# EasyEDA Pro project ProPrj_辉光管时钟V1.0_2025-10-09.epro, board 驱动
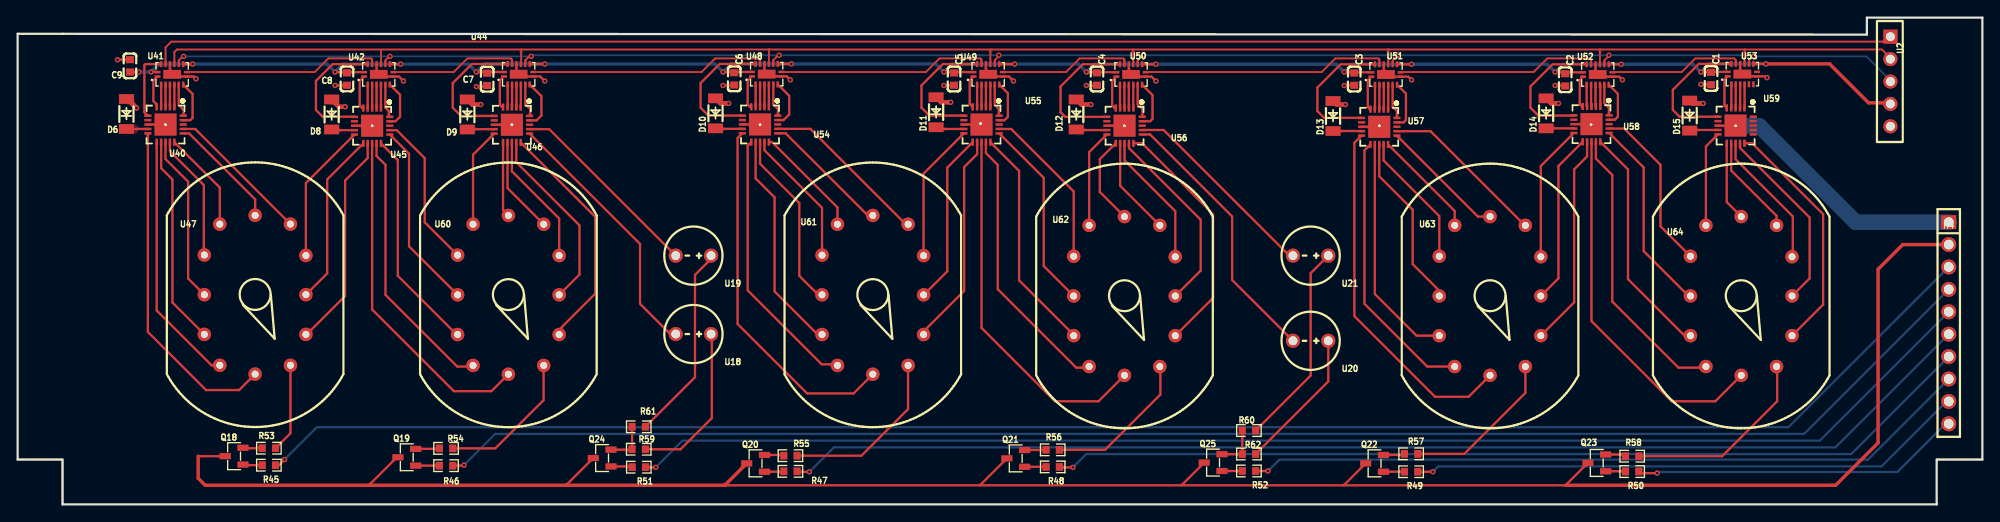
[diagram p12: board, top side]
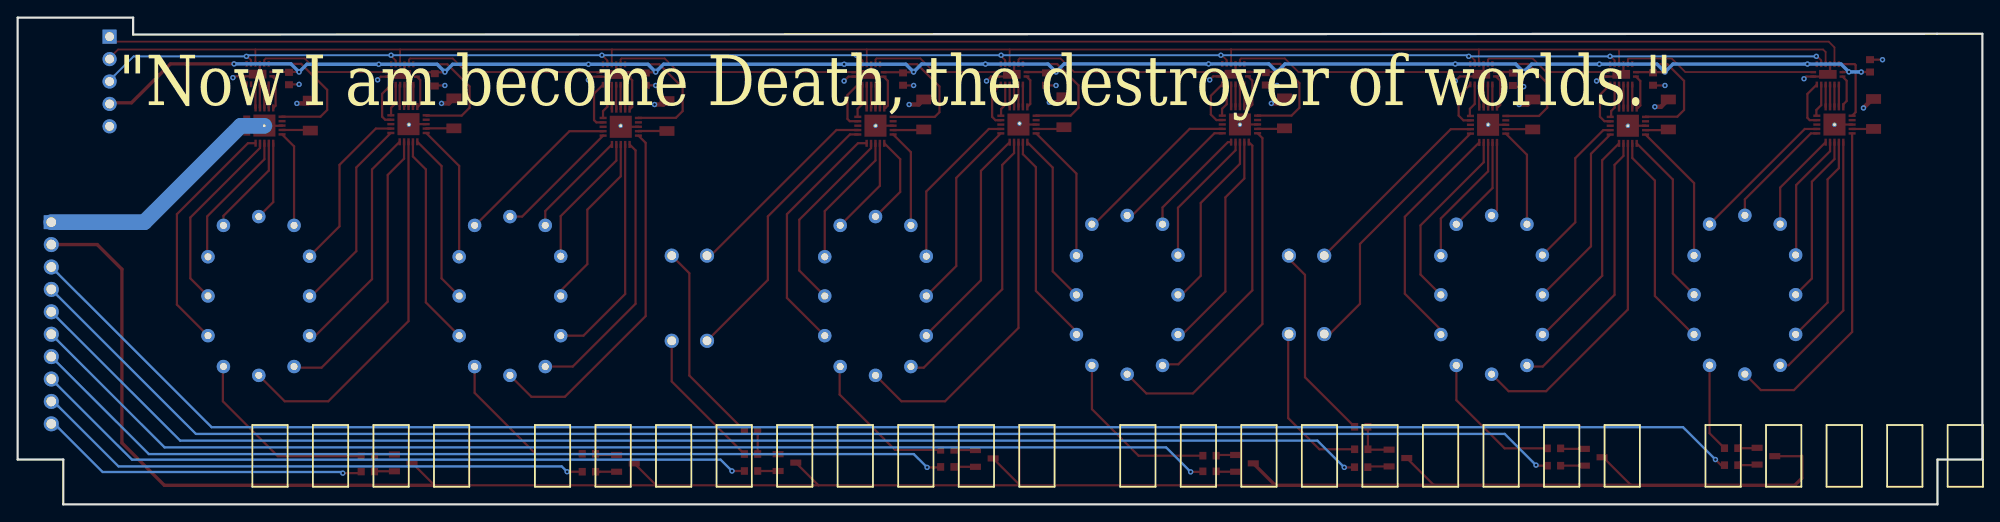
[diagram p13: board, bottom side, seen from below]

Outline 222.5 x 55.17 mm; copper layers: Top Layer, Bottom Layer. Coordinates in mm from the lower left corner of the outline.
Outline path: 0,53.34 0,5.08 5.08,5.08 5.08,0 217.34,0 217.34,5.08 222.5,5.08 222.5,55.17 209.43,55.17 209.43,53.25 5.12,53.34 0,53.34
Stack: Top Layer 0.035mm / Dielectric1 1.51mm FR4 er 4.5 / Bottom Layer 0.035mm

## Design rules (mm)
template: JLCPCB Capability(Two Layers Board)
spacing copperThickness1oz (default): track to track 0.102, other pairs 0.152 to 0.3
spacing copperThickness2oz: track to track 0.203, other pairs 0.152 to 0.3
track width copperThickness1oz (default): min 0.127, default 0.254, max 2.54
track width copperThickness2oz: min 0.203, default 0.254, max 2.54
differential pair differentialPair (default): width min 0.127, default 0.254, max 2.54; gap min 0.152, default 0.152
via viaSize (default): diameter min 0.5, default 0.61, max 10; hole min 0.3, default 0.305, max 6.3

## Placement (name value [footprint] x y rotation side)
C1  100nF  [C0603]  191.78 48.27 270 top
C2  100nF  [C0603]  175.26 48.12 270 top
C3  100nF  [C0603]  151.37 48.2 270 top
C4  100nF  [C0603]  122.23 48.21 270 top
C5  100nF  [C0603]  106.04 48.21 270 top
C6  100nF  [C0603]  81.15 48.23 270 top
C7  100nF  [C0603]  53.17 48.18 270 top
C8  100nF  [C0603]  37.29 48.21 270 top
C9  100nF  [C0603]  12.72 49.71 90 top
D6  ZMM51  [LL-34_L3.5-W1.5-RD]  12.32 44.25 90 top
D8  ZMM51  [LL-34_L3.5-W1.5-RD]  35.56 44.2 90 top
D9  ZMM51  [LL-34_L3.5-W1.5-RD]  50.93 44.2 90 top
D10  ZMM51  [LL-34_L3.5-W1.5-RD]  79.03 44.32 90 top
D11  ZMM51  [LL-34_L3.5-W1.5-RD]  104.01 44.45 90 top
D12  ZMM51  [LL-34_L3.5-W1.5-RD]  119.89 44.2 90 top
D13  ZMM51  [LL-34_L3.5-W1.5-RD]  148.97 44.02 90 top
D14  ZMM51  [LL-34_L3.5-W1.5-RD]  173.1 44.32 90 top
D15  ZMM51  [LL-34_L3.5-W1.5-RD]  189.36 44.07 90 top
H4  MH254V-11-10-1196  [HDR-TH_10P-P2.54-V-M]  218.7 20.56 270 top
NOREF  -  [Pad_e20424]  109.05 43.16 0 top
NOREF#2  -  [Pad_e20423]  84.08 43.04 0 top
NOREF#3  -  [Pad_e20429]  178.19 43.04 0 top
NOREF#4  -  [Pad_e20421]  40.14 42.91 0 top
NOREF#5  -  [Pad_e20428]  194.58 42.91 0 top
NOREF#6  -  [Pad_e20422]  55.97 43.04 0 top
NOREF#7  -  [Pad_e20425]  125.34 42.91 0 top
NOREF#8  -  [Pad_e10921]  16.75 43.04 0 top
NOREF#9  -  [Pad_e20426]  154.22 42.91 0 top
Q18  13001  [SOT-23-3_L2.9-W1.3-P1.90-LS2.4-BR]  24.51 5.46 0 top
Q19  13001  [SOT-23-3_L2.9-W1.3-P1.90-LS2.4-BR]  44.07 5.34 0 top
Q20  13001  [SOT-23-3_L2.9-W1.3-P1.90-LS2.4-BR]  83.57 4.65 0 top
Q21  13001  [SOT-23-3_L2.9-W1.3-P1.90-LS2.4-BR]  113.03 5.21 0 top
Q22  13001  [SOT-23-3_L2.9-W1.3-P1.90-LS2.4-BR]  153.67 4.65 0 top
Q23  13001  [SOT-23-3_L2.9-W1.3-P1.90-LS2.4-BR]  178.84 4.7 0 top
Q24  13001  [SOT-23-3_L2.9-W1.3-P1.90-LS2.4-BR]  66.19 5.25 0 top
Q25  13001  [SOT-23-3_L2.9-W1.3-P1.90-LS2.4-BR]  135.38 4.73 0 top
R45  10K  [R0603]  28.45 4.44 180 top
R46  10K  [R0603]  48.51 4.38 180 top
R47  10K  [R0603]  87.52 3.74 180 top
R48  10K  [R0603]  117.22 4.24 180 top
R49  10K  [R0603]  157.81 3.7 180 top
R50  10K  [R0603]  182.85 3.72 180 top
R51  10K  [R0603]  70.35 4.22 180 top
R52  10K  [R0603]  139.45 3.78 180 top
R53  20K  [R0603]  28.45 6.37 180 top
R54  20K  [R0603]  48.51 6.35 180 top
R55  20K  [R0603]  87.52 5.52 180 top
R56  20K  [R0603]  117.22 6.18 180 top
R57  20K  [R0603]  157.81 5.72 180 top
R58  20K  [R0603]  182.85 5.46 180 top
R59  100K  [R0603]  70.34 6.25 180 top
R60  100K  [R0603]  139.45 5.71 180 top
R61  100K  [R0603]  70.34 8.79 180 top
R62  100K  [R0603]  139.45 8.37 180 top
U2  -  [2.54mm1*5]  212.09 47.93 270 top
U18  -  [6*13氖泡]  76.53 19.3 180 top
U19  -  [6*13氖泡]  76.53 28.19 180 top
U20  -  [6*13氖泡]  146.43 18.54 180 top
U21  -  [6*13氖泡]  146.43 28.19 180 top
U40  ULN2803A  [QFN-20_L4.0-W4.0-P0.50-BL-EP]  16.75 43.05 180 top
U41  74HC595BQ,115  [DHVQFN-16_L3.5-W2.5-P0.50-BL-EP]  17.5 48.74 0 top
U42  74HC595BQ,115  [DHVQFN-16_L3.5-W2.5-P0.50-BL-EP]  40.89 48.74 0 top
U44  74HC595BQ,115  [DHVQFN-16_L3.5-W2.5-P0.50-BL-EP]  56.74 48.76 0 top
U45  ULN2803A  [QFN-20_L4.0-W4.0-P0.50-BL-EP]  40.14 42.92 180 top
U46  ULN2803A  [QFN-20_L4.0-W4.0-P0.50-BL-EP]  55.97 43.03 180 top
U47  -  [IN12]  26.89 23.77 0 top
U48  74HC595BQ,115  [DHVQFN-16_L3.5-W2.5-P0.50-BL-EP]  84.83 48.77 0 top
U49  74HC595BQ,115  [DHVQFN-16_L3.5-W2.5-P0.50-BL-EP]  109.91 48.75 0 top
U50  74HC595BQ,115  [DHVQFN-16_L3.5-W2.5-P0.50-BL-EP]  126.09 48.73 0 top
U51  74HC595BQ,115  [DHVQFN-16_L3.5-W2.5-P0.50-BL-EP]  154.97 48.73 0 top
U52  74HC595BQ,115  [DHVQFN-16_L3.5-W2.5-P0.50-BL-EP]  178.94 48.73 0 top
U53  74HC595BQ,115  [DHVQFN-16_L3.5-W2.5-P0.50-BL-EP]  195.33 48.77 0 top
U54  ULN2803A  [QFN-20_L4.0-W4.0-P0.50-BL-EP]  84.08 43.06 180 top
U55  ULN2803A  [QFN-20_L4.0-W4.0-P0.50-BL-EP]  109.16 43.05 180 top
U56  ULN2803A  [QFN-20_L4.0-W4.0-P0.50-BL-EP]  125.36 42.93 180 top
U57  ULN2803A  [QFN-20_L4.0-W4.0-P0.50-BL-EP]  154.2 42.8 180 top
U58  ULN2803A  [QFN-20_L4.0-W4.0-P0.50-BL-EP]  178.24 43.1 180 top
U59  ULN2803A  [QFN-20_L4.0-W4.0-P0.50-BL-EP]  194.56 42.94 180 top
U60  -  [IN12]  55.58 23.75 0 top
U61  -  [IN12]  96.85 23.75 0 top
U62  -  [IN12]  125.35 23.62 0 top
U63  -  [IN12]  166.75 23.62 0 top
U64  -  [IN12]  195.2 23.62 0 top

## Footprints (pads in the part's own frame, mm; a bottom-side part is the same pattern mirrored in y, then rotated)
2.54mm1*5
  rect 1.6x1.6 hole 1: 1(-5.08,0)
  round 1.6 hole 1: 2(-2.54,0) 3(0,0) 4(2.54,0) 5(5.08,0)
6*13氖泡
  round 1.6 hole 1: 1(-2,0) 2(2,0)
C0603
  rect 0.8x0.9 smd: 1(-0.7,0) 2(0.7,0)
DHVQFN-16_L3.5-W2.5-P0.50-BL-EP
  rect 0.665x0.28 smd: 1(-1.657,-0.25) 8(1.657,-0.25) 9(1.657,0.25) 16(-1.657,0.25)
  rect 0.28x0.665 smd: 2(-1.25,-1.157) 3(-0.75,-1.157) 4(-0.25,-1.157) 5(0.25,-1.157) 6(0.75,-1.157) 7(1.25,-1.157) 10(1.25,1.157) 11(0.75,1.157) 12(0.25,1.157) 13(-0.25,1.157) 14(-0.75,1.157) 15(-1.25,1.157)
  rect 2x1 smd: 17(0,0)
HDR-TH_10P-P2.54-V-M
  rect 1.575x1.7 hole 1.1: 1(-11.43,0)
  round 1.7 hole 1.1: 2(-8.89,0) 3(-6.35,0) 4(-3.81,0) 5(-1.27,0) 6(1.27,0) 7(3.81,0) 8(6.35,0) 9(8.89,0) 10(11.43,0)
IN12
  round 1.524 hole 0.8: 0(5.75,-4.501) 1(-4,-8.001) 2(-5.75,-4.501) 3(-5.75,0) 4(-5.75,4.501) 5(-4,8.001) 6(0,8.999) 7(4,8.001) 8(5.75,4.445) 9(5.75,0) DOT(0,-8.999) HV(4,-8.001)
LL-34_L3.5-W1.5-RD
  rect 1.1x1.7 smd: 1(-1.7,0) 2(1.7,0)
Pad_e10921
  round 0.5 hole 0.305: 22(0,0)
Pad_e20421
  round 0.5 hole 0.305: 22(0,0)
Pad_e20422
  round 0.5 hole 0.305: 22(0,0)
Pad_e20423
  round 0.5 hole 0.305: 22(0,0)
Pad_e20424
  round 0.5 hole 0.305: 22(0,0)
Pad_e20425
  round 0.5 hole 0.305: 22(0,0)
Pad_e20426
  round 0.5 hole 0.305: 22(0,0)
Pad_e20428
  round 0.5 hole 0.305: 22(0,0)
Pad_e20429
  round 0.5 hole 0.305: 22(0,0)
QFN-20_L4.0-W4.0-P0.50-BL-EP
  rect 0.28x0.8 smd: 1(-1,-2) 2(-0.5,-2) 3(0,-2) 4(0.5,-2) 5(1,-2) 11(1,2) 12(0.5,2) 13(0,2) 14(-0.5,2) 15(-1,2)
  rect 0.8x0.28 smd: 6(2,-1) 7(2,-0.5) 8(2,0) 9(2,0.5) 10(2,1) 16(-2,1) 17(-2,0.5) 18(-2,0) 19(-2,-0.5) 20(-2,-1)
  rect 2.5x2.5 smd: 21(0,0)
R0603
  rect 0.806x0.864 smd: 1(-0.753,0) 2(0.753,0)
SOT-23-3_L2.9-W1.3-P1.90-LS2.4-BR
  rect 1.25x0.7 smd: 1(1,-0.95) 2(1,0.95) 3(-1,0)

## Nets
As in the schematic, except:
170V: H4.2 Q18.3 Q19.3 Q20.3 Q21.3 Q22.3 Q23.3 Q24.3 Q25.3
170_GND: D6.2 D8.2 D9.2 D10.2 D11.2 D12.2 D13.2 D14.2 D15.2 H4.1 NOREF.22 NOREF#2.22 NOREF#3.22 NOREF#4.22 NOREF#5.22 NOREF#6.22 NOREF#7.22 NOREF#8.22 NOREF#9.22 U40.8 U40.21 U45.8 U45.21 U46.8 U46.21 U54.8 U54.21 U55.8 U55.21 U56.8 U56.21 U57.8 U57.21 U58.8 U58.21 U59.8 U59.21
B_HV: R54.1 U60.HV
C_HV: R55.1 U61.HV
COLON1: H4.5 R51.1
COLON2: H4.8 R52.1
D_HV: R56.1 U62.HV
G_HV2: R61.1 U19.1
H_HV1: R60.1 U20.1
SWITCH1: H4.3 R45.1
SWITCH2: H4.4 R46.1
SWITCH3: H4.6 R47.1
SWITCH4: H4.7 R48.1
SWITCH5: H4.9 R49.1
SWITCH6: H4.10 R50.1
$1N13344: Q18.1 R45.2
$1N13345: Q19.1 R46.2
$1N13346: Q20.1 R47.2
$1N13347: Q21.1 R48.2
$1N13348: Q22.1 R49.2
$1N13349: Q23.1 R50.2
$1N13350: Q24.1 R51.2
$1N13351: Q25.1 R52.2
$1N13352: Q18.2 R53.2
$1N13353: Q19.2 R54.2
$1N13354: Q20.2 R55.2
$1N13355: Q21.2 R56.2
$1N13358: Q23.2 R58.2
$1N13359: Q22.2 R57.2
$1N24687: Q24.2 R59.2 R61.2
$1N24696: Q25.2 R60.2 R62.2

Pads without a net: U40 7 18; U45 7 18; U46 7 18; U53 6 7 9; U54 7 18; U55 7 18; U56 7 18; U57 7 18; U58 7 18; U59 7 16 17 18 19 20

## Via types
v1: diameter 0.61, hole 0.305, Top Layer to Bottom Layer, 63 vias

## Routing (per net, layer and track width the routed paths; a pad name or vN(x,y) marks a point on that pad's centre or on a via; arc(x,y) is an arc through that point)
170V: length 254.4
  Top Layer w0.254: Q23.3 175.3,2.16 150.18,2.16 ; 131.81,2.16 108.98,2.16 ; 131.81,2.16 Q25.3 ; 131.81,2.16 150.18,2.16 ; 108.98,2.16 Q21.3 ; 108.98,2.16 80.16,2.16 ; Q24.3 62.1,2.16 ; 42.94,5.33 39.77,2.16 ; 20.45,5.46 Q18.3 ; Q22.3 150.18,2.16
  Top Layer w0.381: Q20.3 80.16,2.24 80.16,2.16 21.24,2.16 20.45,2.96 20.45,5.46 ; H4.2 213.49,29.45 210.7,26.65 210.7,6.97 205.89,2.16 175.3,2.16
+5V: length 247.4
  Top Layer w0.254: v1(174.12,49.01) 174.15,48.98 U52.16 ; v1(150.25,49.01) 150.28,48.98 U51.16 ; C9.1 13.72,49.01 v1(13.72,49.01) ; U53.10 v1(197.99,49.93) ; U49.16 104.91,49 v1(104.91,49.01) ; v1(121.03,49.01) 121.06,48.98 U50.16 ; U49.10 v1(112.9,49.91) ; U48.10 v1(87.63,49.93) ; v1(51.95,49.01) 51.95,49.01 U44.16 ; U42.16 35.96,48.99 v1(35.94,49.01) ; U44.10 v1(59.69,49.92) ; U52.10 v1(181.61,49.88) ; v1(79.89,49.01) 79.9,49.02 U48.16 ; U51.10 v1(157.86,49.88) ; v1(190.63,49.01) 190.65,49.02 U53.16 ; v1(19.81,49.91) 19.8,49.9 U41.10 ; U50.10 v1(128.91,49.89) ; U42.10 v1(43.37,49.9) ; U41.16 15.81,49.02 v1(15.11,49.02)
  Top Layer w0.381: v1(197.99,49.93) 205.2,49.93 209.61,45.52 212.09,45.52
  Bottom Layer w0.381: v1(13.72,49.01) 13.74,49.02 v1(15.11,49.02) 16,49.91 v1(19.81,49.91) 35.04,49.91 v1(35.94,49.01) 36.84,49.9 v1(43.37,49.9) 51.05,49.9 v1(51.95,49.01) 52.86,49.92 v1(59.69,49.92) 78.98,49.92 v1(79.89,49.01) 80.81,49.93 v1(87.63,49.93) 103.99,49.93 v1(104.91,49.01) 105.81,49.91 v1(112.9,49.91) 120.13,49.91 v1(121.03,49.01) 121.92,49.89 v1(128.91,49.89) 149.36,49.89 v1(150.25,49.01) 151.12,49.88 v1(157.86,49.88) 173.24,49.88 v1(174.12,49.01) 175,49.88 v1(181.61,49.88) 189.75,49.88 v1(190.63,49.01) 191.55,49.93 v1(197.99,49.93)
GND: length 51.3
  Top Layer w0.254: C2.2 175.2,47.48 v1(174.12,47.48) ; U49.13 109.66,48.5 U49.8 112.27,48.5 v1(112.78,47.99) ; U44.13 56.49,48.8 56.78,48.51 U44.8 59.18,48.51 v1(59.69,47.99) ; C7.2 53.04,47.35 v1(51.95,47.35) ; U41.13 17.25,49.05 17.8,48.49 U41.8 19.95,48.49 v1(20.2,48.24) ; v1(87.51,48.12) 87.11,48.52 U48.8 84.87,48.52 84.58,48.81 U48.13 ; C8.2 37.26,47.48 v1(35.94,47.48) ; v1(181.74,48.12) 181.38,48.48 U52.8 179.09,48.48 178.69,48.88 U52.13 ; 106.04,47.51 106.02,47.48 v1(104.91,47.48) ; v1(190.63,47.61) 191.74,47.61 C1.2 ; v1(79.89,47.48) 81.1,47.48 C6.2 ; v1(11.31,50.4) 11.31,50.41 C9.2 ; 125.84,49.89 125.84,48.85 126.21,48.48 U50.8 128.41,48.48 v1(128.91,47.99) ; v1(121.03,47.48) 122.21,47.48 122.23,47.51 ; 154.72,49.88 154.72,48.6 154.84,48.48 U51.8 157.51,48.48 v1(157.87,48.12) ; v1(43.69,47.99) 43.19,48.49 41,48.49 40.64,48.84 U42.13 ; v1(150.25,47.48) 150.26,47.5 C3.2 ; U53.13 195.08,48.83 195.38,48.52 197.97,48.52 v1(198.12,48.37)
170_GND: length 62.3
  Top Layer w0.254: U45.8 U45.21 ; U40.8 U40.21 ; U55.8 U55.21 ; U58.8 U58.21 ; U59.8 192.59,42.91 194.57,42.91 ; U46.8 U46.21 ; U54.8 U54.21 ; U57.8 U57.21 ; U56.8 U56.21
  Top Layer w0.508: v1(121.54,45.32) 120.46,45.32 D12.2 ; v1(174.5,45.45) 173.67,45.45 D14.2 ; v1(80.52,45.45) 79.6,45.45 D10.2 ; v1(190.88,45.45) 189.68,45.45 189.36,45.77 ; v1(13.46,44.93) 12.44,45.95 D6.2 ; D13.2 149.37,45.32 v1(150.37,45.32) ; v1(37.09,45.07) 36.39,45.07 D8.2 ; v1(52.45,45.32) 51.5,45.32 D9.2 ; D11.2 104.59,45.58 v1(105.67,45.58)
  Bottom Layer w1.778: H4.1 208.16,31.99 197.24,42.91 194.57,42.91
A0: length 2.7
  Top Layer w0.254: U42.2 U45.4
A1: length 3.8
  Top Layer w0.254: U41.1 15.37,48.02 15.37,45.72 15.75,45.34 U40.5
A2: length 2.5
  Top Layer w0.254: U41.2 16.25,45.05
A3: length 2.5
  Top Layer w0.254: U41.3 U40.3
A4: length 2.5
  Top Layer w0.254: U41.4 17.25,45.05
A5: length 2.5
  Top Layer w0.254: U41.5 U40.1
A6: length 3.8
  Top Layer w0.254: U41.6 18.25,45.25 18.8,44.7 18.8,44.1 U40.20
A7: length 5.4
  Top Layer w0.254: U40.19 19.55,43.55 19.81,43.81 19.81,46.52 U41.7
A8: length 14.6
  Top Layer w0.254: U42.15 35.68,49.9 33.78,48.01 33.78,44.7 34.54,43.94 38.12,43.94 U45.6
A9: length 4
  Top Layer w0.254: U42.1 38.73,47.99 38.73,45.21 39.03,44.92 U45.5
A_HV: length 10.1
  Top Layer w0.254: U47.HV 30.89,8.06 R53.1
ADOT: length 7.8
  Top Layer w0.254: U40.6 14.35,44.45 14.35,49.79 14.46,49.9 U41.15
B0: length 2.6
  Top Layer w0.254: U44.5 56.99,45.05 U46.1
B1: length 2.7
  Top Layer w0.254: U42.4 U45.2
B2: length 2.7
  Top Layer w0.254: U42.5 U45.1
B3: length 3.9
  Top Layer w0.254: U42.6 41.64,44.97 42.04,44.58 42.04,44.03 U45.20
B4: length 5.5
  Top Layer w0.254: U45.19 42.16,43.43 42.8,43.43 43.31,43.94 43.31,46.42 U42.7
B5: length 15
  Top Layer w0.254: U46.6 50.2,44.03 49.28,44.96 49.28,47.75 51.44,49.92 U44.15
B6: length 3.9
  Top Layer w0.254: U44.1 54.61,48.04 54.61,45.28 54.86,45.03 U46.5
B7: length 2.6
  Top Layer w0.254: U44.2 55.49,45.05 U46.4
B8: length 2.6
  Top Layer w0.254: U44.3 55.99,45.05 U46.3
B9: length 2.6
  Top Layer w0.254: U46.2 56.49,45.05 U44.4
B_HV: length 16.5
  Top Layer w0.254: R54.1 54.1,6.35 59.56,11.81 59.56,15.74 U60.HV
BDOT: length 2.7
  Top Layer w0.254: U42.3 U45.3
C0: length 2.5
  Top Layer w0.254: U49.2 108.66,45.05
C1: length 3.9
  Top Layer w0.254: U54.5 82.93,45.06 82.68,45.32 82.68,48.02 U48.1
C2: length 2.5
  Top Layer w0.254: U48.2 U54.4
C3: length 2.5
  Top Layer w0.254: U48.3 U54.3
C4: length 2.5
  Top Layer w0.254: U48.4 U54.2
C5: length 2.5
  Top Layer w0.254: U48.5 U54.1
C6: length 3.8
  Top Layer w0.254: U48.6 85.58,45.36 86.11,44.83 86.11,44.09 U54.20
C7: length 5.5
  Top Layer w0.254: U48.7 87.38,46.31 87.38,44.2 86.74,43.56 86.08,43.56 U54.19
C8: length 15
  Top Layer w0.254: U55.6 107.14,44.07 103.25,44.07 102.36,44.96 102.36,47.5 104.77,49.91 U49.15
C9: length 3.8
  Top Layer w0.254: U55.5 107.82,45.39 107.82,48.07 U49.1
C_HV: length 19.7
  Top Layer w0.254: R55.1 95.56,5.52 100.84,10.8 100.84,15.74 100.85,15.75
CDOT: length 15
  Top Layer w0.254: U48.15 79.52,49.93 77.34,47.75 77.34,44.96 78.23,44.07 82.07,44.07 U54.6
CLK: length 205.7
  Top Layer w0.203: 126.84,49.89 126.84,50.33 127.43,50.91 v1(127.51,50.91) ; 155.72,49.88 155.72,50.32 156.31,50.91 v1(156.34,50.91) ; v1(111.13,50.91) 111.13,50.81 110.66,50.34 U49.11 ; U53.11 196.08,50.36 196.5,50.78 v1(196.6,50.78) ; U48.11 85.58,50.36 86.13,50.91 v1(86.24,50.91) ; U41.11 18.25,50.34 18.7,50.78 v1(18.8,50.78) ; v1(58.17,50.78) 57.92,50.78 57.49,50.35 U44.11 ; v1(180.22,50.91) 180.22,50.84 179.69,50.32 U52.11 ; v1(42.17,50.78) 42.09,50.78 41.64,50.34 U42.11
  Bottom Layer w0.203: v1(18.8,50.78) v1(42.17,50.78) v1(58.17,50.78) 58.3,50.91 v1(86.24,50.91) v1(111.13,50.91) v1(127.51,50.91) v1(156.34,50.91) v1(180.22,50.91) 196.47,50.91 v1(196.6,50.78) 209.37,50.78 212.09,48.06
COLON1: length 154.9
  Top Layer w0.254: R51.1 71.13,4.19 v1(72.26,4.19)
  Bottom Layer w0.254: v1(72.26,4.19) 75.3,7.22 204.09,7.22 H4.5
COLON2: length 82.8
  Top Layer w0.254: R52.1 v1(141.6,3.78)
  Bottom Layer w0.254: H4.8 209.55,5.06 142.89,5.06 v1(141.6,3.78)
CS: length 208.6
  Top Layer w0.203: 155.19,51.56 155.22,51.54 U51.12 ; 155.19,51.56 126.34,51.56 ; 155.19,51.56 179.19,51.56 ; 85.09,51.56 85.08,51.55 85.08,50.05 ; 85.09,51.56 57.02,51.56 ; 85.09,51.56 85.09,51.56 110.16,51.56 ; 195.58,51.56 179.19,51.56 ; 195.58,51.56 195.58,49.93 U53.12 ; 195.58,51.56 211.13,51.56 212.09,50.6 ; 179.19,51.56 179.19,50.01 ; 110.16,51.56 110.16,50.04 ; 110.16,51.56 126.34,51.56 ; 57.02,51.56 18.03,51.56 17.75,51.27 17.75,50.03 ; 57.02,51.56 57.02,50.08 56.99,50.04 ; 126.34,50.02 126.34,51.56 ; 41.15,51.44 41.14,51.43 U42.12
D0: length 2.6
  Top Layer w0.254: 126.36,44.94 126.34,44.95 U50.5
D1: length 2.5
  Top Layer w0.254: U49.4 109.66,45.05
D2: length 2.5
  Top Layer w0.254: U49.5 U55.1
D3: length 3.7
  Top Layer w0.254: U55.20 111.13,44.08 111.13,44.81 110.66,45.28 U49.6
D4: length 5.2
  Top Layer w0.254: U55.19 111.17,43.55 111.76,43.55 112.15,43.93 112.15,46.61 U49.7
D5: length 16.2
  Top Layer w0.254: 124.84,49.89 120.63,49.89 118.11,47.37 118.11,44.45 118.63,43.93 U56.6
D6: length 4
  Top Layer w0.254: U50.1 123.95,48 123.95,45.21 124.23,44.94 124.36,44.94
D7: length 2.6
  Top Layer w0.254: 124.86,44.94 124.84,44.95 124.84,47.58
D8: length 2.6
  Top Layer w0.254: 125.36,44.94 125.34,44.95 U50.3
D9: length 2.6
  Top Layer w0.254: 125.84,47.58 125.84,44.95 125.86,44.94
D_HV: length 17.2
  Top Layer w0.254: U62.HV 129.41,15.56 129.41,12.45 123.15,6.18 R56.1
DDOT: length 2.5
  Top Layer w0.254: U49.3 U55.3
E0: length 2.5
  Top Layer w0.254: U52.2 177.69,45.15 U58.4
E1: length 4
  Top Layer w0.254: U57.5 153.16,44.8 152.91,45.05 152.91,48.07 U51.1
E2: length 2.8
  Top Layer w0.254: U57.4 153.72,44.82 153.72,47.57
E3: length 2.8
  Top Layer w0.254: U51.3 154.22,44.82 U57.3
E4: length 2.8
  Top Layer w0.254: 154.72,47.57 154.72,44.82 U57.2
E5: length 2.8
  Top Layer w0.254: U57.1 155.22,44.82 U51.5
E6: length 4
  Top Layer w0.254: U57.20 156.21,43.81 156.21,44.58 155.72,45.07 155.72,47.57
E7: length 5.6
  Top Layer w0.254: U57.19 156.96,43.3 157.23,43.56 157.23,46.56 U51.7
E8: length 15.1
  Top Layer w0.254: U58.6 176.21,44.07 172.21,44.07 171.32,44.96 171.32,47.37 173.84,49.88 U52.15
E9: length 3.7
  Top Layer w0.254: U52.1 176.91,48.1 176.91,45.35 177.16,45.1 U58.5
E_HV: length 18
  Top Layer w0.254: R57.1 163.84,5.72 170.75,12.64 U63.HV
EDOT: length 15.6
  Top Layer w0.254: 153.72,49.88 149.83,49.88 147.19,47.24 147.19,44.58 147.96,43.81 152.19,43.81 U57.6
F0: length 2.7
  Top Layer w0.254: U53.5 195.58,44.96 U59.1
F1: length 2.5
  Top Layer w0.254: U52.4 178.69,45.15 U58.2
F2: length 2.5
  Top Layer w0.254: U58.1 179.24,47.52 U52.5
F3: length 3.7
  Top Layer w0.254: U52.6 179.69,45.48 180.21,44.96 180.21,44.13 U58.20
F4: length 5.2
  Top Layer w0.254: U58.19 180.89,43.6 181.23,43.94 181.23,46.53 U52.7
F5: length 15.6
  Top Layer w0.254: U59.6 192.56,43.94 188.21,43.94 187.45,44.7 187.45,46.99 190.39,49.93 U53.15
F6: length 3.9
  Top Layer w0.254: U53.1 193.29,48.15 193.29,45.19 193.55,44.94 U59.5
F7: length 2.7
  Top Layer w0.254: U59.4 194.08,44.96 U53.2
F8: length 2.7
  Top Layer w0.254: U59.3 194.58,44.96 U53.3
F9: length 2.7
  Top Layer w0.254: U59.2 195.08,44.96 U53.4
F_HV: length 22.2
  Top Layer w0.254: U64.HV 199.26,15.56 199.26,11.68 193.04,5.46 R58.1
FDOT: length 2.5
  Top Layer w0.254: U52.3 178.19,45.15 U58.3
G0: length 3.8
  Top Layer w0.254: U44.6 57.49,45.38 58.04,44.83 58.04,44.1 U46.20
G1: length 5.6
  Top Layer w0.254: U44.7 59.31,46.28 59.31,44.07 58.77,43.53 U46.19
G_HV1: length 18.5
  Top Layer w0.254: R59.1 75.08,6.25 78.61,9.78 78.61,19.22 U18.1
G_HV2: length 22.5
  Top Layer w0.254: U19.1 78.53,27.83 76.71,26.02 76.71,14.41 R61.1
H0: length 3.9
  Top Layer w0.254: 126.84,47.58 126.84,45.37 127.38,44.83 127.38,43.96 127.36,43.94
H1: length 5.7
  Top Layer w0.254: 127.36,43.44 127.36,43.43 128.27,43.43 128.52,43.69 128.52,46.39 U50.7
H_HV1: length 16.2
  Top Layer w0.254: R60.1 148.43,13.94 U20.1
H_HV2: length 23.2
  Top Layer w0.254: R62.1 146.44,14.6 146.44,26.2 U21.1
MOSI: length 197.5
  Top Layer w0.203: 16.75,50.16 16.75,51.8 17.4,52.45 211.41,52.45
  Top Layer w0.254: 212.09,53.14 211.41,52.45
NIX_A0: length 24.6
  Top Layer w0.254: U45.12 39.64,39.26 37.08,36.7 37.08,23.62 32.73,19.26 U47.0
NIX_A1: length 28.8
  Top Layer w0.254: U47.1 21.95,15.76 15.75,21.97 U40.11
NIX_A2: length 23.8
  Top Layer w0.254: U47.2 17.53,22.88 17.53,36.83 16.25,38.11 U40.12
NIX_A3: length 19.1
  Top Layer w0.254: U47.3 19.3,25.6 19.3,36.58 16.75,39.13 U40.13
NIX_A4: length 14.4
  Top Layer w0.254: U47.4 21.08,28.33 21.08,36.19 17.25,40.03 U40.14
NIX_A5: length 11.4
  Top Layer w0.254: U47.5 22.89,35.91 U40.15
NIX_A6: length 13.1
  Top Layer w0.254: U47.6 26.89,34.57 19.41,42.05 U40.16
NIX_A7: length 16.6
  Top Layer w0.254: U40.17 20.11,42.55 U47.7
NIX_A8: length 16
  Top Layer w0.254: U45.10 32.64,36.42 U47.8
NIX_A9: length 19.8
  Top Layer w0.254: U47.9 35.05,26.17 35.05,36.83 U45.11
NIX_ADOT: length 38.1
  Top Layer w0.254: U47.DOT 25.08,12.95 21.34,12.95 14.75,19.54 U40.10
NIX_B0: length 27
  Top Layer w0.254: U46.15 65.41,32.6 65.41,23.88 61.33,19.8 61.33,19.25
NIX_B1: length 30.9
  Top Layer w0.254: U45.14 40.64,39.49 41.66,38.48 41.66,23.75 49.78,15.62 51.45,15.62 U60.1
NIX_B2: length 25.3
  Top Layer w0.254: U60.2 49.71,19.25 43.05,25.91 43.05,39.01 U45.15
NIX_B3: length 21.4
  Top Layer w0.254: U45.16 44.32,39.74 44.32,29.25 U60.3
NIX_B4: length 17.8
  Top Layer w0.254: U45.17 42.93,42.42 46.1,39.24 46.1,31.97 U60.4
NIX_B5: length 11.3
  Top Layer w0.254: U46.10 51.58,39.63 U60.5
NIX_B6: length 8.5
  Top Layer w0.254: U60.6 54.97,33.35 U46.11
NIX_B7: length 11
  Top Layer w0.254: U60.7 55.47,35.85 U46.12
NIX_B8: length 15.1
  Top Layer w0.254: 61.33,28.19 61.33,32.4 55.97,37.75 U46.13
NIX_B9: length 21.2
  Top Layer w0.254: 61.33,23.75 63.63,26.05 63.63,31.62 56.47,38.78 U46.14
NIX_BDOT: length 38.9
  Top Layer w0.254: U45.13 40.14,22.09 49.4,12.83 53.65,12.83 U60.DOT
NIX_C0: length 24.3
  Top Layer w0.254: U61.0 102.6,19.61 107.19,24.2 107.19,38.23 108.66,39.7 U55.12
NIX_C1: length 30.7
  Top Layer w0.254: U61.1 92.72,15.88 91.06,15.88 82.68,24.26 82.68,40.66 U54.11
NIX_C2: length 25.2
  Top Layer w0.254: U61.2 90.61,19.25 85.72,24.13 85.72,34.8 83.58,36.95 U54.12
NIX_C3: length 20.5
  Top Layer w0.254: U54.13 84.08,38.6 88.52,34.16 88.52,25.91 90.68,23.75 U61.3
NIX_C4: length 15.5
  Top Layer w0.254: U54.14 84.58,40.14 91.1,33.62 U61.4
NIX_C5: length 12.7
  Top Layer w0.254: U61.5 92.85,33.65 85.44,41.06 U54.15
NIX_C6: length 14.6
  Top Layer w0.254: U61.6 96.28,32.75 86.97,42.06 U54.16
NIX_C7: length 19.2
  Top Layer w0.254: 100.85,31.75 100.58,31.75 89.77,42.56 U54.17
NIX_C8: length 15.7
  Top Layer w0.254: U55.10 102.6,37.49 U61.8
NIX_C9: length 19.6
  Top Layer w0.254: U61.9 102.62,23.75 105.28,26.42 105.28,38.18 U55.11
NIX_CDOT: length 41.3
  Top Layer w0.254: U54.10 81.53,41.52 81.53,20.45 89.41,12.57 94.67,12.57 U61.DOT
NIX_D0: length 27.9
  Top Layer w0.254: 131.1,19.12 135.38,23.4 135.38,32.89 127.34,40.94 126.36,40.94
NIX_D1: length 31.3
  Top Layer w0.254: U62.1 121.22,15.49 119.89,15.49 111,24.38 111,38.48 109.66,39.82 U55.14
NIX_D2: length 25.8
  Top Layer w0.254: U55.15 113.41,37.8 113.41,25.4 119.6,19.21 U62.2
NIX_D3: length 21.9
  Top Layer w0.254: U62.3 116.21,27.02 116.21,37.01 U55.16
NIX_D4: length 18.7
  Top Layer w0.254: U55.17 112.51,42.55 119.6,35.47 U62.4
NIX_D5: length 11.1
  Top Layer w0.254: U62.5 121.35,39.93 123.36,41.94
NIX_D6: length 10.2
  Top Layer w0.254: 124.36,40.94 122.56,39.13 122.56,35.42 125.35,32.62
NIX_D7: length 11.2
  Top Layer w0.254: U62.7 124.86,36.12 124.86,40.94
NIX_D8: length 15.2
  Top Layer w0.254: 131.1,28.07 131.1,33.24 125.36,38.98 125.36,40.94
NIX_D9: length 21.9
  Top Layer w0.254: 131.1,23.62 133.99,26.51 133.99,32.26 125.86,40.39 125.86,40.94
NIX_DDOT: length 41.9
  Top Layer w0.254: U55.13 109.16,20 117.47,11.68 122.41,11.68 U62.DOT
NIX_E0: length 24.1
  Top Layer w0.254: U58.12 177.74,39.44 176.28,37.97 176.28,22.9 U63.0
NIX_E1: length 31.5
  Top Layer w0.254: U57.11 152.53,40.12 152.53,22.73 159.64,15.62 U63.1
NIX_E2: length 26.2
  Top Layer w0.254: U57.12 153.7,23.84 158.43,19.12 U63.2
NIX_E3: length 20
  Top Layer w0.254: U57.13 154.2,37.19 157.99,33.4 157.99,27.23 161,24.22 U63.3
NIX_E4: length 15.3
  Top Layer w0.254: U57.14 154.7,38.97 161,32.67 U63.4
NIX_E5: length 12.3
  Top Layer w0.254: U63.5 162.75,33.25 U57.15
NIX_E6: length 14.4
  Top Layer w0.254: U57.16 156.2,41.79 165.37,32.62 166.75,32.62
NIX_E7: length 19
  Top Layer w0.254: U63.7 170.69,31.62 160.01,42.3 U57.17
NIX_E8: length 15.6
  Top Layer w0.254: U58.10 172.5,38.36 U63.8
NIX_E9: length 19.4
  Top Layer w0.254: U58.11 174.5,38.36 174.5,25.62 U63.9
NIX_EDOT: length 41
  Top Layer w0.254: U57.10 151.38,40.98 151.38,21.34 160.53,12.19 164.32,12.19 U63.DOT
NIX_F0: length 27.5
  Top Layer w0.254: U59.15 196.42,40.94 204.47,32.89 204.47,22.64 U64.0
NIX_F1: length 32.6
  Top Layer w0.254: U64.1 191.07,15.49 188.09,15.49 180.59,22.99 180.59,37.34 178.74,39.19 U58.14
NIX_F2: length 26.6
  Top Layer w0.254: U58.15 182.37,37.97 182.37,25.53 188.78,19.12 U64.2
NIX_F3: length 22.4
  Top Layer w0.254: U58.16 184.15,38.19 184.15,28.7 189.23,23.62 U64.3
NIX_F4: length 19.3
  Top Layer w0.254: U64.4 186.06,31.52 186.06,38.48 181.94,42.6 U58.17
NIX_F5: length 10.9
  Top Layer w0.254: U59.10 191.2,40.58 U64.5
NIX_F6: length 9
  Top Layer w0.254: U59.11 193.56,34.26 195.2,32.62
NIX_F7: length 11.4
  Top Layer w0.254: U64.7 199.2,32.7 194.06,37.84 U59.12
NIX_F8: length 15.6
  Top Layer w0.254: U59.13 194.56,39.12 201.04,32.64 201.04,28.16 U64.8
NIX_F9: length 21.4
  Top Layer w0.254: U64.9 202.95,25.62 202.95,32.51 195.06,40.4 U59.14
NIX_FDOT: length 42.3
  Top Layer w0.254: U58.13 178.24,20.77 187.32,11.68 192.26,11.68 U64.DOT
NIX_G0: length 29.9
  Top Layer w0.254: U46.16 70.48,29.52 70.48,22.73 73.91,19.3 U18.2
NIX_G1: length 22.5
  Top Layer w0.254: U19.2 60.2,42.53 U46.17
NIX_H0: length 31
  Top Layer w0.254: U20.2 137.54,25.43 137.54,32.64 128.24,41.94 127.36,41.94
NIX_H1: length 23
  Top Layer w0.254: U21.2 144.02,28.19 129.78,42.44 127.36,42.44
SWITCH1: length 198.8
  Top Layer w0.254: R45.1 29.59,4.44 v1(30.23,5.08)
  Bottom Layer w0.254: v1(30.23,5.08) 33.89,8.75 200.54,8.75 H4.3
SWITCH2: length 177.7
  Top Layer w0.254: R46.1 50.49,4.38 v1(50.55,4.44)
  Bottom Layer w0.254: v1(50.55,4.44) 54.09,7.98 202.31,7.98 H4.4
SWITCH3: length 136.9
  Top Layer w0.254: R47.1 88.34,3.68 v1(89.66,3.68)
  Bottom Layer w0.254: H4.6 205.87,6.46 92.44,6.46 v1(89.66,3.68)
SWITCH4: length 105.9
  Top Layer w0.254: R48.1 118.03,4.19 v1(119.51,4.19)
  Bottom Layer w0.254: v1(119.51,4.19) 121.01,5.7 207.65,5.7 H4.7
SWITCH5: length 63.4
  Top Layer w0.254: R49.1 v1(160.27,3.7)
  Bottom Layer w0.254: 218.7,11.29 218.56,11.42 218.2,11.42 211.08,4.3 160.89,4.3 160.28,3.7 v1(160.27,3.7)
SWITCH6: length 37.3
  Top Layer w0.254: v1(185.68,3.54) 183.78,3.54 R50.1
  Bottom Layer w0.254: H4.10 218.44,8.87 218.08,8.87 212.88,3.67 185.81,3.67
$1N13344: length 2.2
  Top Layer w0.254: Q18.1 25.58,4.44 R45.2
$1N13345: length 2.7
  Top Layer w0.254: Q19.1 47.76,4.39 R46.2
$1N13346: length 2.2
  Top Layer w0.254: R47.2 86.72,3.7 Q20.1
$1N13347: length 2.4
  Top Layer w0.254: Q21.1 116.45,4.26 116.47,4.24
$1N13348: length 2.4
  Top Layer w0.254: R49.2 157.03,3.67 156.59,3.67 156.56,3.7 Q22.1
$1N13349: length 2.3
  Top Layer w0.254: Q23.1 182.06,3.75 R50.2
$1N13350: length 2.4
  Top Layer w0.254: Q24.1 69.51,4.3 R51.2
$1N13351: length 2.3
  Top Layer w0.254: Q25.1 R52.2
$1N13352: length 2.2
  Top Layer w0.254: R53.2 25.56,6.37 25.51,6.41
$1N13353: length 2.7
  Top Layer w0.254: R54.2 47.7,6.29 Q19.2
$1N13354: length 2.2
  Top Layer w0.254: Q20.2 86.69,5.6 R55.2
$1N13355: length 2.4
  Top Layer w0.254: Q21.2 116.44,6.16 116.47,6.18
$1N13358: length 2.3
  Top Layer w0.254: Q23.2 181.91,5.65 R58.2
$1N13359: length 2.4
  Top Layer w0.254: Q22.2 156.93,5.6 R57.2
$1N13394: length 22.2
  Top Layer w0.203: 19.29,49.01 33.64,49.01 35.18,50.55 40.05,50.55 40.14,50.45 40.14,49.77
$1N13396: length 14.6
  Top Layer w0.203: 55.99,49.79 55.99,50.41 55.86,50.55 50.93,50.55 49.39,49.01 42.69,49.01
$1N13403: length 2.5
  Top Layer w0.254: 12.38,42.55 U40.9 ; 12.38,42.55 D6.1 ; 12.38,42.55 12.32,42.5
$1N13404: length 2.6
  Top Layer w0.254: U45.9 35.64,42.42 D8.1
$1N13405: length 3.1
  Top Layer w0.254: D9.1 50.96,42.53 U46.9
$1N13668: length 3.1
  Top Layer w0.254: D10.1 79.09,42.56 U54.9
$1N13669: length 3.2
  Top Layer w0.254: U55.9 104.21,42.55 D11.1
$1N13670: length 3.5
  Top Layer w0.254: U56.9 119.96,42.43 D12.1
$1N13767: length 3.2
  Top Layer w0.254: U57.9 152.18,42.32 D13.1
$1N13768: length 3.1
  Top Layer w0.254: U58.9 176.22,42.62 D14.1
$1N13769: length 3.2
  Top Layer w0.254: U59.9 189.43,42.44 D15.1
$1N13978: length 26.9
  Top Layer w0.203: 84.08,49.8 84.07,49.8 84.07,50.42 83.95,50.55 78.99,50.55 77.45,49.01 58.52,49.01
$1N13979: length 23.9
  Top Layer w0.203: 86.6,49.01 102.85,49.01 104.39,50.55 109.03,50.55 109.16,50.42 109.16,49.78
$1N13980: length 15
  Top Layer w0.203: 125.34,49.76 125.35,49.77 125.35,50.43 125.23,50.55 120.27,50.55 118.73,49.01 111.7,49.01
$1N13981: length 27.7
  Top Layer w0.203: 154.22,49.76 154.22,50.44 154.11,50.55 149.22,50.55 147.69,49.01 127.9,49.01
$1N13982: length 22.8
  Top Layer w0.203: 178.19,49.76 178.19,50.41 178.05,50.55 173.23,50.55 171.69,49.01 156.78,49.01
$1N13983: length 15.1
  Top Layer w0.203: 180.76,49.01 188.45,49.01 189.99,50.55 194.41,50.55 194.58,50.38 194.58,49.8
$1N24687: length 5
  Top Layer w0.254: Q24.2 69.54,6.2 R59.2 R61.2
$1N24696: length 5
  Top Layer w0.254: R62.2 R60.2 138.67,5.68 Q25.2

## Copper pours and planes (outline as drawn; the poured copper is in the pictures)
GND on Bottom Layer: -5.58,66.15 252.23,66.15 252.23,-6.37 -5.58,-6.37
GND on Bottom Layer: 212.03,43.85 209.63,43.85 204.22,49.26 193.31,49.26 193.31,48.16 193.29,48.15 190.76,48.15 190.76,49.33 176.55,49.33 176.55,47.88 176.53,47.86 174.12,47.86 173.61,48.88 173.36,49.35 152.5,49.35 152.5,47.99 150.25,47.99 150.25,49.35 123.34,49.35 123.34,48.02 121.26,48.02 121.16,48.12 121.16,49.35 107.19,49.35 107.19,47.93 104.84,47.93 104.78,47.99 104.78,49.36 82.55,49.36 82.55,48.07 82.54,48.06 79.91,48.06 79.91,49.38 54.56,49.38 54.56,48.06 54.49,47.99 51.82,47.99 51.82,49.4 38.74,49.4 38.74,48 38.73,47.99 35.86,47.99 35.86,49.34 35.82,49.39 16.26,49.39 16.26,47.99 11.61,47.99 11.61,49.78 13.97,49.78 13.97,52.94 9.78,52.94 9.78,46.95 197.62,46.95 203.69,40.88 214.76,40.88 214.76,43.67 214.89,43.8 212.03,43.8
170_GND on Bottom Layer: 10.16,41.02 67.69,41.02 69.6,42.93 73.41,42.93 75.56,40.77 196.98,40.77 196.98,46.35 196.98,46.48 10.16,46.48

Small or netless copper shapes (teardrops, artwork), in the pictures only: 579 on Top Layer, 79 on Bottom Layer

## Text on the board
Bottom Silkscreen Layer: श्री भगवानुवाच कालोऽस्मि लोकक्षयकृत्प्रवृद्धो | "Now I am become Death, the destroyer of worlds."
Top Silkscreen Layer: 宽距应该设置为3倍窄距+窄距-实际窄距 = 700mil
